# Altium project Control_Prj.PrjPcb
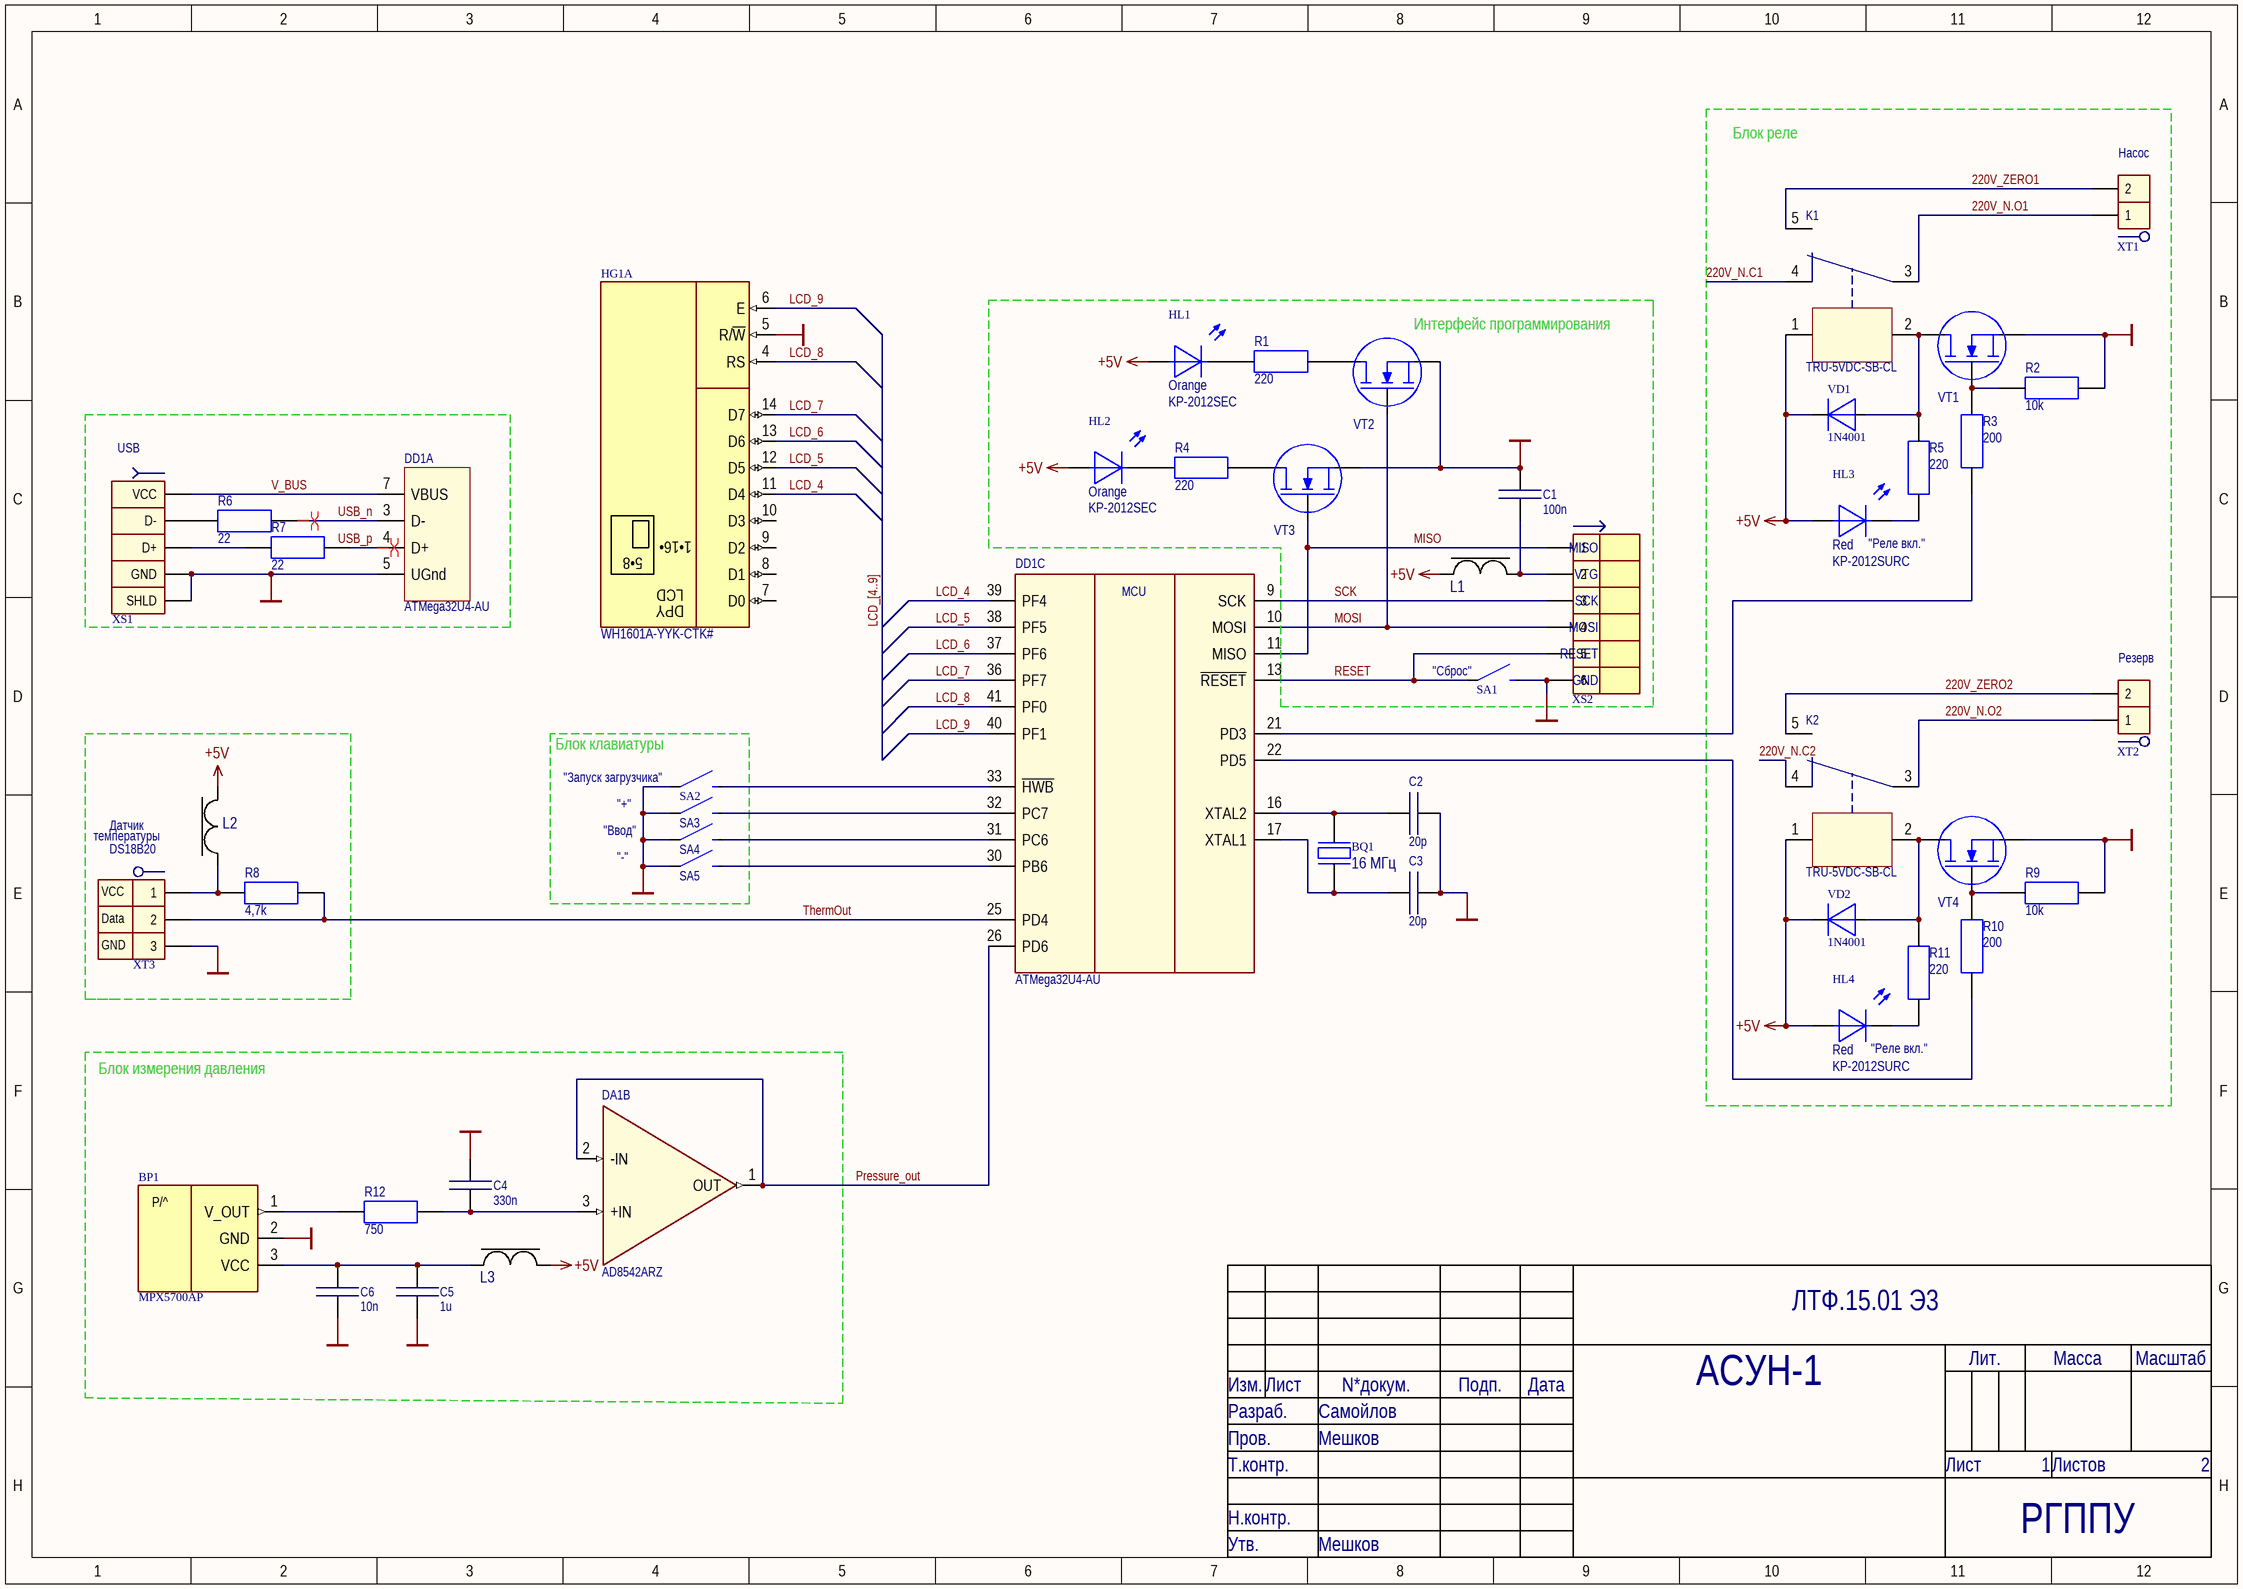
[diagram p0: Control_SCH.SchDoc]
2 sheets, 75 parts. Net scope: global (net labels, ports and power ports of the same name join across sheets).
Board file: Control_PCB.PcbDoc
Sheets:
  Control_SCH.SchDoc
  Power_SCH.SchDoc

## Sheet Control_SCH.SchDoc: АСУН-1
size 420 x 297 mm; Date: 22.06.2015; ApprovedBy: Мешков; CheckedBy: Мешков; Author: Самойлов; CompanyName: РГППУ; DocumentNumber: 1; SheetNumber: 1; SheetTotal: 2; DecimalNumber: ЛТФ.15.01 Э3

### Parts
BP1  MPX5700AP  [MPX5700AP]
BQ1  16 МГц  [HC-49/S]
C1  100n  [SMDRC0805]
C2  20p  [SMDRC0805]
C3  20p  [SMDRC0805]
C4  330n  [SMDRC0805]
C5  1u  [SMDRC0805]
C6  10n  [SMDRC0805]
DA1  AD8542ARZ  [AD8542ARZ]  (part B of 3)
DD1  ATMega32U4-AU  [44ML_L]  (parts A,C of 3)
HG1  WH1601A-YYK-CTK#  [WH1601A]  (part A of 2)
HL1  Orange  ManufacturerPartNumber: KP-2012SEC  [DIOMELF2012M]
HL2  Orange  ManufacturerPartNumber: KP-2012SEC  [DIOMELF2012M]
HL3  Red  ManufacturerPartNumber: KP-2012SURC  [DIOMELF2012M]
HL4  Red  ManufacturerPartNumber: KP-2012SURC  [DIOMELF2012M]
K1  TRU-5VDC-SB-CL  [TRU-5VDC-SB-CL]
K2  TRU-5VDC-SB-CL  [TRU-5VDC-SB-CL]
L1  MPZ1608S181A  [INDC0603X03M]  (value not drawn)
L2  MPZ1608S181A  [INDC0603X03M]  (value not drawn)
L3  MPZ1608S181A  [INDC0603X03M]  (value not drawn)
R1  220  [SMDRC0805]
R2  10k  [SMDRC0805]
R3  200  [SMDRC0805]
R4  220  [SMDRC0805]
R5  220  [SMDRC0805]
R6  22  [SMDRC0805]
R7  22  [SMDRC0805]
R8  4,7k  [SMDRC0805]
R9  10k  [SMDRC0805]
R10  200  [SMDRC0805]
R11  220  [SMDRC0805]
R12  750  [SMDRC0805]
SA1  DTSM20-4.3  [DTSM20]  (value not drawn)
SA2  DTSM20-4.3  [DTSM20]  (value not drawn)
SA3  SWT14-13  [SWT14]  (value not drawn)
SA4  SWT14-13  [SWT14]  (value not drawn)
SA5  SWT14-13  [SWT14]  (value not drawn)
VD1  1N4001  [PinDiode]
VD2  1N4001  [PinDiode]
VT1  2N7002  [SOT23 (TO-236AB)]  (value not drawn)
VT2  2N7002  [SOT23 (TO-236AB)]  (value not drawn)
VT3  2N7002  [SOT23 (TO-236AB)]  (value not drawn)
VT4  2N7002  [SOT23 (TO-236AB)]  (value not drawn)
XS1  USB B A-09 РОЗЕТКА НА ПЛАТУ  [USB2.0B_Vertical]  (value not drawn)
XS2  IDC-06M  [IDC-06M]  (value not drawn)
XT1  305-021-12  [305-021-12]  (value not drawn)
XT2  305-021-12  [305-021-12]  (value not drawn)
XT3  305-031-12  [305-031-12]  (value not drawn)

### Blocks framed on the sheet
Блок реле: HL3 HL4 K1 K2 R2 R3 R5 R9-R11 VD1 VD2 VT1 VT4 XT1 XT2
Интерфейс программирования: C1 HL1 HL2 L1 R1 R4 SA1 VT2 VT3 XS2
USB: DD1 R6 R7 XS1
Блок клавиатуры: SA2-SA5
Блок измерения давления: BP1 C4-C6 DA1 L3 R12

### Nets
+5V: HL1.1 HL2.1 HL3.1 HL4.1 K1.1 K2.1 L1.1 L2.2 L3.2 VD1.K VD2.K
GND: BP1.2(GND) C1.2 C2.2 C3.2 C4.2 C5.1 C6.1 DD1.5(UGnd) HG1.5(R/~{W}) R2.2 R9.2 SA1.2 SA2.1 SA3.1 SA4.1 SA5.1 VT1.2(S) VT2.2(S) VT3.2(S) VT4.2(S) XS1.GND XS1.SHLD XS2.6 XT3.3
220V_N.C1: K1.4
220V_N.C2: K2.4
220V_N.O1: K1.3 XT1.1
220V_N.O2: K2.3 XT2.1
220V_ZERO1: K1.5 XT1.2
220V_ZERO2: K2.5 XT2.2
LCD_4: DD1.39(PF4) HG1.11(D4)
LCD_5: DD1.38(PF5) HG1.12(D5)
LCD_6: DD1.37(PF6) HG1.13(D6)
LCD_7: DD1.36(PF7) HG1.14(D7)
LCD_8: DD1.41(PF0) HG1.4(RS)
LCD_9: DD1.40(PF1) HG1.6(E)
MISO: DD1.11(MISO) VT3.1(G) XS2.1
MOSI: DD1.10(MOSI) VT2.1(G) XS2.4
Pressure_out: DA1.1(OUT) DA1.2(-IN) DD1.26(PD6)
RESET: DD1.13(~{RESET}) SA1.1 XS2.5
SCK: DD1.9(SCK) XS2.3
ThermOut: DD1.25(PD4) R8.2 XT3.2
USB_n: DD1.3(D-) R6.1
V_BUS: DD1.7(VBUS) XS1.VCC
NetBP1_1: BP1.1(V_OUT) R12.1
NetBP1_3: BP1.3(VCC) C5.2 C6.2 L3.1
NetBQ1_1: BQ1.1 C3.1 DD1.17(XTAL1)
NetBQ1_2: BQ1.2 C2.1 DD1.16(XTAL2)
NetC1_1: C1.1 L1.2 XS2.2
NetC4_1: C4.1 DA1.3(+IN) R12.2
NetDD1_4: DD1.4(D+) R7.1
NetDD1_21: DD1.21(PD3) R3.1
NetDD1_22: DD1.22(PD5) R10.1
NetDD1_30: DD1.30(PB6) SA5.2
NetDD1_31: DD1.31(PC6) SA4.2
NetDD1_32: DD1.32(PC7) SA3.2
NetDD1_33: DD1.33(~{HWB}) SA2.2
NetHL1_2: HL1.2 R1.2
NetHL2_2: HL2.2 R4.2
NetHL3_2: HL3.2 R5.2
NetHL4_2: HL4.2 R11.2
NetK1_2: K1.2 R5.1 VD1.A VT1.3(D)
NetK2_2: K2.2 R11.1 VD2.A VT4.3(D)
NetL2_1: L2.1 R8.1 XT3.1
NetR1_1: R1.1 VT2.3(D)
NetR2_1: R2.1 R3.2 VT1.1(G)
NetR4_1: R4.1 VT3.3(D)
NetR6_2: R6.2 XS1.D-
NetR7_2: R7.2 XS1.D+
NetR9_1: R9.1 R10.2 VT4.1(G)

Not connected (* = marked no-connect by the designer): HG1 7(D0) 8(D1) 9(D2) 10(D3)

### Buses and harness runs
bus LCD_[4..9]

### Layout directives
differential pair: NetDD1_4, USB_n

### Notes on the sheet
- (near XT1) Насос
- (near HL3) "Реле вкл."
- (near XT2) Резерв
- (near SA1) "Сброс"
- (near SA2) "Запуск загрузчика"
- температуры
- Датчик
- (near XT3) DS18B20
- "Ввод"
- "+"
- "-"
- (near XT3) VCC
- (near XT3) Data
- (near XT3) GND
- (near HL4) "Реле вкл."
- Labels drawn without touching a wire or pin: USB_p
- Изм.
- Лист
- N*докум.
- Подп.
- Дата
- Лит.
- Масса
- Масштаб
- Разраб.
- Пров.
- Т.контр.
- Лиcт
- Лиcтов
- Н.контр.
- Утв.
- (in symbol ATMega32U4, part C) MCU
- (in symbol Con6_M IDC-06M_SPI) MISO; VTG; SCK; MOSI; RESET; GND
- (in symbol LCD 1601A, part A) 1•16•; 5•8; LCD; DPY
- (in symbol MPX5700AP) P/^

### Library data of the parts
BP1 = MPX5700AP: Pressure sensor, 700kPa; Manufacturer: Freescale Semiconductor; ManufacturerPartNumber: MPX5700AP; ComponentLink1URL: http://cache.freescale.com/files/sensors/doc/data_sheet/MPX5700.pdf; ComponentLink1Description: Datasheet; Cost: 806.86; Package: 867B-04; ComponentLink2URL: http://www.promelec.ru/pdf/mpx5700.pdf; ComponentLink2Description: Datasheet-promelec; Supplier: Промэлектроника
BQ1 = Piezoelectric_16000: Piezoelectric elements; Manufacturer: Taizhou; ManufacturerPartNumber: 16000 кГц 20ppm 20pF; ComponentLink1URL: http://www.promelec.ru/catalog_info/54/126/246/70/; ComponentLink1Description: Datasheet; Package: HC-49/S; Cost: 8,54; Supplier: Промэлектроника; ComponentLink2Description: Datasheet-local; Value: 16 МГц
C1 = Capacitor 0805 100n: Generic capasitor non-polar; PartNumber: Capacitor 0805 100n; Value: 100n; ComponentLink1Description: Datasheet; Package: 0805
C2 C3 = Capacitor 0805 20p: Generic capasitor non-polar; PartNumber: Capacitor 0805 20p; Value: 20p; ComponentLink1Description: Datasheet; Package: 0805
C4 = Capacitor 0805 330n: Generic capasitor non-polar; PartNumber: Capacitor 0805 330n; Value: 330n; ComponentLink1Description: Datasheet; Package: 0805
C5 = Capacitor 0805 1u: Generic capasitor non-polar; PartNumber: Capacitor 0805 1u; Value: 1u; ComponentLink1Description: Datasheet; Package: 0805
C6 = Capacitor 0805 10n: Generic capasitor non-polar; PartNumber: Capacitor 0805 10n; Value: 10n; ComponentLink1Description: Datasheet; Package: 0805
DD1 = ATMega32U4: ManufacturerPartNumber: ATMega32U4-AU
HG1 = LCD 1601A: Liquid crystal display; Manufacturer: Winstar; ComponentLink1URL: http://www.promelec.ru/pdf/wh1602l.pdf; ComponentLink1Description: Datasheet; ComponentLink2Description: Datasheet-local; ComponentLink2URL: *; ManufacturerPartNumber: WH1601A-YYK-CTK#
HL1 HL2 = LED1_O: Diod LED SMD Orange; ComponentLink1Description: Datasheet; Cost: 4,91; ComponentLink2Description: Datasheet-local; ComponentLink2URL: *; Color: Orange
HL3 HL4 = LED1_R: Diod LED SMD Red; ComponentLink1Description: Datasheet; Cost: 5,01; ComponentLink2Description: Datasheet-local; ComponentLink2URL: *; Color: Red
L1-L3 = Ferrite Bead: Value: ? мГн; ManufacturerPartNumber: MPZ1608S181A; ComponentLink1Description: Datasheet; Supplier: Промэлектроника; ComponentLink2Description: Datasheet-local; ComponentLink2URL: *
R1 R4 R5 R11 = Resistor 0805 220: Generic resistor; PartNumber: Resistor 0805 220; Value: 220; ComponentLink1URL: http://www.mouser.com/ds/2/447/PYu-RC0402_51_RoHS_L_6_r-8721.pdf; ComponentLink1Description: Datasheet; Package: 0805
R2 R9 = Resistor 0805 10k: Generic resistor; PartNumber: Resistor 0805 10k; Value: 10k; ComponentLink1URL: http://www.mouser.com/ds/2/447/PYu-RC0402_51_RoHS_L_6_r-8721.pdf; ComponentLink1Description: Datasheet; Package: 0805
R3 R10 = Resistor 0805 200: Generic resistor; PartNumber: Resistor 0805 200; Value: 200; ComponentLink1URL: http://www.mouser.com/ds/2/447/PYu-RC0402_51_RoHS_L_6_r-8721.pdf; ComponentLink1Description: Datasheet; Package: 0805
R6 R7 = Resistor 0805 22: Generic resistor; PartNumber: Resistor 0805 22; Value: 22; ComponentLink1URL: http://www.mouser.com/ds/2/447/PYu-RC0402_51_RoHS_L_6_r-8721.pdf; ComponentLink1Description: Datasheet; Package: 0805
R8 = Resistor 0805 4,7k: Generic resistor; PartNumber: Resistor 0805 4,7k; Value: 4,7k; ComponentLink1URL: http://www.mouser.com/ds/2/447/PYu-RC0402_51_RoHS_L_6_r-8721.pdf; ComponentLink1Description: Datasheet; Package: 0805
R12 = Resistor 0805 750: Generic resistor; PartNumber: Resistor 0805 750; Value: 750; ComponentLink1URL: http://www.mouser.com/ds/2/447/PYu-RC0402_51_RoHS_L_6_r-8721.pdf; ComponentLink1Description: Datasheet; Package: 0805
SA1 SA2 = Switch1_DTSM20-4.3: Switch open; Manufacturer: Diptronics; ManufacturerPartNumber: DTSM20-4.3; ComponentLink1Description: Datasheet; ComponentLink1URL: http://www.promelec.ru/catalog/407/1291/1323/1/70721/; ComponentLink2Description: Datasheet-local; ComponentLink2URL: *
SA3-SA5 = SWT-14-13: ManufacturerPartNumber: SWT14-13
VD1 VD2 = 1N4001: Rectifying diode; ComponentLink1Description: Datasheet; ComponentLink1URL: http://www.promelec.ru/pdf/1N400x.pdf; Cost: 5; Package: штырьевой; ComponentLink2Description: Datasheet-local; ComponentLink2URL: *; ManufacturerPartNumber: 1N4001
VT1-VT4 = 2N7002 n-MOSFET: 60V, 300mA N-channel Trench MOSFET; ManufacturerPartNumber: 2N7002
XS1 = USB2.0-BR: USB-B Vertical; ManufacturerPartNumber: USB B A-09 РОЗЕТКА НА ПЛАТУ; ComponentLink1Description: Datasheet; ComponentLink1URL: http://www.promelec.ru/catalog/406/1229/1281/1/124861/; ComponentLink2Description: Datasheet-local; ComponentLink2URL: *
XS2 = Con6_M IDC-06M_SPI: SPI connector; ManufacturerPartNumber: IDC-06M; ComponentLink1Description: Datasheet; ComponentLink1URL: http://www.promelec.ru/catalog/406/1218/1223/1/156430/; ComponentLink2Description: Datasheet-local; ComponentLink2URL: *
XT1 XT2 = Con2_D 305-021-12: Demountable connection  2-pin; Manufacturer: Degson Electronics Co., Ltd; ManufacturerPartNumber: 305-021-12; ComponentLink1Description: Datasheet; Cost: 7,45; Supplier: Промэлектроника; ComponentLink2Description: Datasheet-local
XT3 = Con3_D 305-031-12: Demountable connection 3-pin; Manufacturer: Degson Electronics Co., Ltd; ManufacturerPartNumber: 305-031-12; ComponentLink1Description: Datasheet; Cost: 13; Supplier: Промэлектроника; ComponentLink2Description: Datasheet-local
DA1 = AD8542ARZ: ManufacturerPartNumber: AD8542ARZ
K1 K2 = TRU-5VDC-SB-CL: ManufacturerPurtNumber: TRU-5VDC-SB-CL

## Sheet Power_SCH.SchDoc: АСУН-1
size 420 x 297 mm; ApprovedBy: Мешков; CheckedBy: Мешков; Author: Самойлов; CompanyName: РГППУ; DocumentNumber: 2; SheetNumber: 2; SheetTotal: 2; DecimalNumber: ЛТФ.15.01 Э3
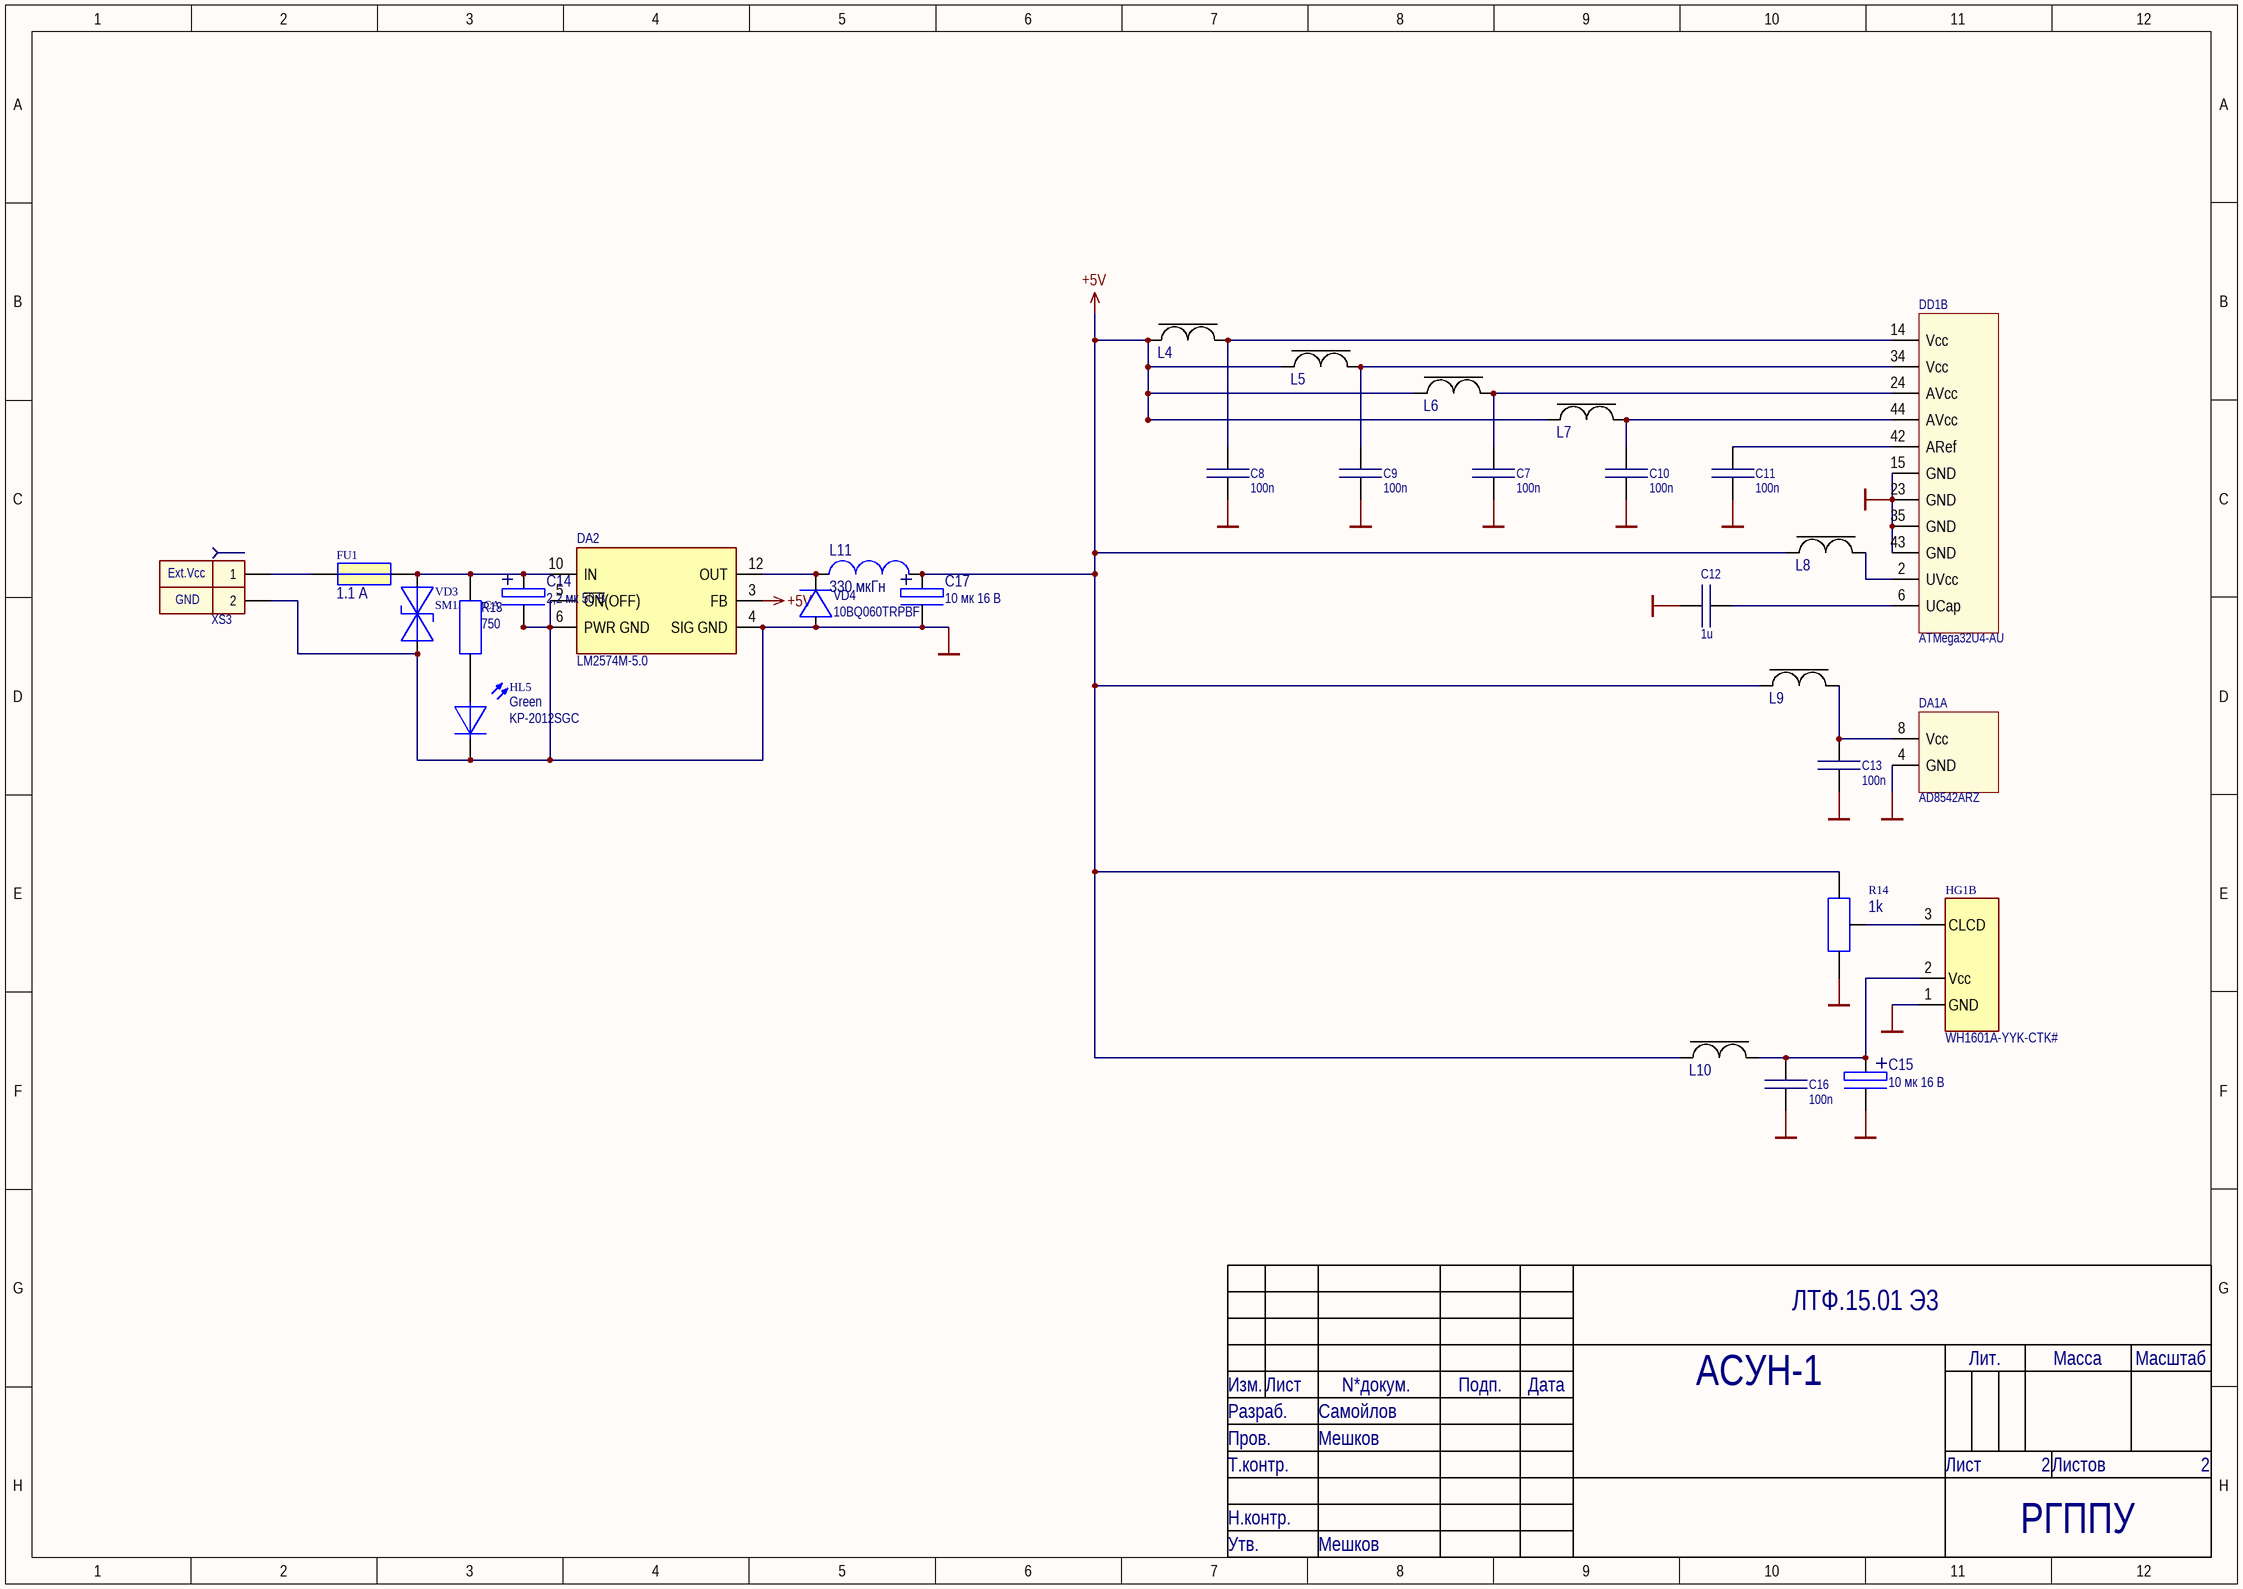
[diagram p1: Power_SCH.SchDoc]

### Parts
C7  100n  [SMDRC0805]
C8  100n  [SMDRC0805]
C9  100n  [SMDRC0805]
C10  100n  [SMDRC0805]
C11  100n  [SMDRC0805]
C12  1u  [SMDRC0805]
C13  100n  [SMDRC0805]
C14  value 2,2 мк 50 В  [CAP_POLAR_ELLYTE_B]  (hidden comment: CA050M2R20REB-0405)
C15  value 10 мк 16 В  [CAP_POLAR_ELLYTE_B]  (hidden comment: CA016M0010REB-0405)
C16  100n  [SMDRC0805]
C17  value 10 мк 16 В  [CAP_POLAR_ELLYTE_B]  (hidden comment: CA016M0010REB-0405)
DA1  AD8542ARZ  [AD8542ARZ]  (part A of 3)
DA2  LM2574M-5.0  [SOIC127P1030X264-14M]
DD1  ATMega32U4-AU  [44ML_L]  (part B of 3)
FU1  value 1.1 А  [EFuse 1.1A]  (hidden comment: EFuse LP60-110F)
HG1  WH1601A-YYK-CTK#  [WH1601A]  (part B of 2)
HL5  Green  ManufacturerPartNumber: KP-2012SGC  [DIOMELF2012M]
L4  MPZ1608S181A  [INDC0603X03M]  (value not drawn)
L5  MPZ1608S181A  [INDC0603X03M]  (value not drawn)
L6  MPZ1608S181A  [INDC0603X03M]  (value not drawn)
L7  MPZ1608S181A  [INDC0603X03M]  (value not drawn)
L8  MPZ1608S181A  [INDC0603X03M]  (value not drawn)
L9  MPZ1608S181A  [INDC0603X03M]  (value not drawn)
L10  MPZ1608S181A  [INDC0603X03M]  (value not drawn)
L11  value 330 мкГн  [INDP7972X50M]  (hidden comment: SCD0705T-331K-N)
R13  750  [SMDRC0805]
R14  value 1k  [T93YA]  (hidden comment: T93YA102KT20)
VD3  SM15T12CA  [SUPRES3216X18N]
VD4  10BQ060TRPBF  [SHOTKY 4.1x3.3]
XS3  330-031-12  [330-031-12]  (value not drawn)

### Nets
+5V: C17.2(+) DA2.3(FB) L4.2 L5.2 L6.2 L7.2 L8.2 L9.1 L10.2 L11.1 R14.3
GND: C7.2 C8.2 C9.2 C10.2 C11.1 C12.2 C13.2 C14.1(-) C15.1(-) C16.2 C17.1(-) DA1.4(GND) DA2.4(SIG_GND) DA2.5(~{ON}(OFF)) DA2.6(PWR_GND) DD1.15(GND) DD1.23(GND) DD1.35(GND) DD1.43(GND) HG1.1(GND) HL5.2 R14.1 VD3.1 VD4.A XS3.2
NetC7_1: C7.1 DD1.24(AVсс) L6.1
NetC8_1: C8.1 DD1.14(Vсс) L4.1
NetC9_1: C9.1 DD1.34(Vсс) L5.1
NetC10_1: C10.1 DD1.44(AVсс) L7.1
NetC11_2: C11.2 DD1.42(ARef)
NetC12_1: C12.1 DD1.6(UCap)
NetC13_1: C13.1 DA1.8(Vcc) L9.2
NetC14_2: C14.2(+) DA2.10(IN) FU1.2 R13.2 VD3.2
NetC15_2: C15.2(+) C16.1 HG1.2(Vcc) L10.1
NetDA2_12: DA2.12(OUT) L11.2 VD4.K
NetDD1_2: DD1.2(UVcc) L8.1
NetFU1_1: FU1.1 XS3.1
NetHG1_3: HG1.3(CLCD) R14.2
NetHL5_1: HL5.1 R13.1

### Notes on the sheet
- (near XS3) Ext.Vcc
- (near XS3) GND
- Изм.
- Лист
- N*докум.
- Подп.
- Дата
- Лит.
- Масса
- Масштаб
- Разраб.
- Пров.
- Т.контр.
- Лиcт
- Лиcтов
- Н.контр.
- Утв.

### Library data of the parts
C7-C11 C13 C16 = Capacitor 0805 100n: Generic capasitor non-polar; PartNumber: Capacitor 0805 100n; Value: 100n; ComponentLink1Description: Datasheet; Package: 0805
C12 = Capacitor 0805 1u: Generic capasitor non-polar; PartNumber: Capacitor 0805 1u; Value: 1u; ComponentLink1Description: Datasheet; Package: 0805
C14 = 02200_050: 2,2uF 50V Polar capacitor; Manufacturer: Yageo; ManufacturerPartNumber: CA050M2R20REB-0405; Supplier: Промэлектроника; Cost: 4,11; Package: not standard; ComponentLink1Description: Datasheet; ComponentLink1URL: http://www.yageo.com/documents/recent/E-Cap_SurfaceMount_CA_2011.pdf; ComponentLink2Description: Datasheet-local; ComponentLink2URL: *
C15 C17 = 10000_016: 10uF 16V Polar SMD cap; Manufacturer: YAGEO; ManufacturerPartNumber: CA016M0010REB-0405; Supplier: -; Cost: 3,03; Package: штырьевой; ComponentLink1Description: Datasheet; ComponentLink2Description: Datasheet-local
DD1 = ATMega32U4: ManufacturerPartNumber: ATMega32U4-AU
FU1 = EFuse LP60-110F: Fuse; ManufacturerPartNumber: EFuse LP60-110F; ComponentLink1Description: Datasheet; ComponentLink2Description: Datasheet-local; ComponentLink2URL: *
HG1 = LCD 1601A: as HG1 on sheet Control_SCH; ComponentLink1URL: http://www.promelec.ru/pdf/wh1602l.pdf; ComponentLink1Description: Datasheet; ComponentLink2Description: Datasheet-local; ComponentLink2URL: *; ManufacturerPartNumber: WH1601A-YYK-CTK#
HL5 = LED1_G: Diod LED SMD Green; ComponentLink1Description: Datasheet; Cost: 2,88; ComponentLink2Description: Datasheet-local; ComponentLink2URL: *; Color: Green
L4-L10 = Ferrite Bead: Value: ? мГн; ManufacturerPartNumber: MPZ1608S181A; ComponentLink1Description: Datasheet; Supplier: Промэлектроника; ComponentLink2Description: Datasheet-local; ComponentLink2URL: *
L11 = SCD0705T-331K-N: Inductor; ManufacturerPartNumber: SCD0705T-331K-N; ComponentLink1Description: Datasheet; ComponentLink1URL: http://download.siliconexpert.com/pdfs/2010/12/8/6/47/4/732/yageo_/manual/inductors_smdpower_scd_2010.pdf; ComponentLink2Description: Datasheet-local; ComponentLink2URL: *
R13 = Resistor 0805 750: Generic resistor; PartNumber: Resistor 0805 750; Value: 750; ComponentLink1URL: http://www.mouser.com/ds/2/447/PYu-RC0402_51_RoHS_L_6_r-8721.pdf; ComponentLink1Description: Datasheet; Package: 0805
R14 = Res trim_1k: Resistor trimming; Manufacturer: VISHAY; ManufacturerPartNumber: T93YA102KT20; ComponentLink1Description: Datasheet; ComponentLink1URL: http://www.vishay.com/docs/51026/t93.pdf; Cost: 38.41; Package: not standard; ComponentLink2Description: Datasheet-local; ComponentLink2URL: *
VD3 = SM15T12CA: Diod suppressor; Manufacturer: ST Microelectronics; Notes: 12 В; ComponentLink1Description: Datasheet; ComponentLink1URL: http://www.st.com/st-web-ui/static/active/en/resource/technical/document/datasheet/CD00000724.pdf; Cost: 16,73; Package: SMC/DO-214AB; Supplier: Промэлектроника; ComponentLink2Description: Datasheet-local; ComponentLink2URL: *; ManufacturerPartNumber: SM15T12CA
VD4 = 10BQ060TRPBF: DIODE SCHOTTKY 60V 1A DO214AA; Manufacturer: Vishay Semiconductor Diodes Division; Voltage - Forward (Vf) (Max) @ If: 600mV @ 1A; Current - Reverse Leakage @ Vr: 100µA @ 60V; Category: Discrete Semiconductor Products; Diode Type: Schottky; Voltage - DC Reverse (Vr) (Max): 60V; Current - Average Rectified (Io): 1A; Reverse Recovery Time (trr): -; Mounting Type: Surface Mount; Package / Case: DO-214AA, SMB; Operating Temperature - Junction: -55°C ~ 150°C; ComponentLink1URL: http://www.vishay.com/docs/94113/vs-10bq060pbf.pdf; ComponentLink1Description: http://www.vishay.com/docs/94113/vs-10bq060pbf.pdf; ManufacturerPartNumber: 10BQ060TRPBF
DA1 = AD8542ARZ: ManufacturerPartNumber: AD8542ARZ
DA2 = LM2574M-5.0: ManufacturerPartNumber: LM2574M-5.0
XS3 = 330-031-12: ManufacturerPartNumber: 330-031-12

## Nets that join several sheets
+5V: Control_SCH (11 pins), Power_SCH (11 pins)
GND: Control_SCH (24 pins), Power_SCH (25 pins)